# Altium schematic sheet JTAG.SchDoc: TAG Connector
size A4; DocumentNumber: MB1248; Revision: A.1; SheetNumber: 12; SheetTotal: 14; Project: STM32H7-DK
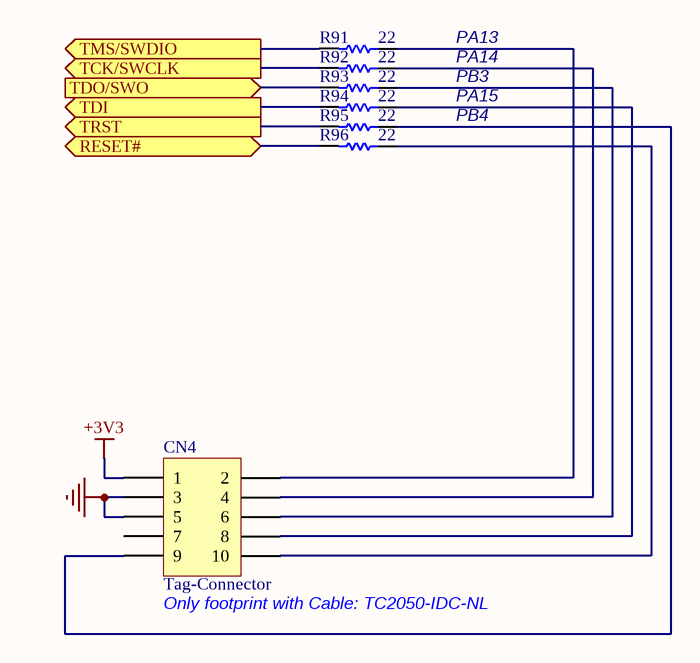
[diagram p0: JTAG.SchDoc]

## Parts
CN4  Tag-Connector  [TC2050-IDC-FP]
R91  22  [0603R]
R92  22  [0603R]
R93  22  [0603R]
R94  22  [0603R]
R95  22  [0603R]
R96  22  [0603R]

## Ports
RESET# (bidir), TCK/SWCLK (out), TDI (out), TDO/SWO (in), TMS/SWDIO (out), TRST (out)

## Nets
+3V3: CN4.1
GND: CN4.3 CN4.5
RESET#: R96.2 ; port RESET#
TCK/SWCLK: R92.2 ; port TCK/SWCLK
TDI: R94.2 ; port TDI
TDO/SWO: R93.2 ; port TDO/SWO
TMS/SWDIO: R91.2 ; port TMS/SWDIO
TRST: R95.2 ; port TRST
NetCN4_2: CN4.2 R91.1
NetCN4_4: CN4.4 R92.1
NetCN4_6: CN4.6 R93.1
NetCN4_8: CN4.8 R94.1
NetCN4_9: CN4.9 R95.1
NetCN4_10: CN4.10 R96.1

Not connected (* = marked no-connect by the designer): CN4 7

## Notes on the sheet
- PA13
- PA14
- PB3
- PA15
- PB4
- (near CN4) Only footprint with Cable: TC2050-IDC-NL
- Title:
- Project:
- Size:
- Date:
- A4
- Reference:
- Sheet:
- Revision:
- of

## Library data of the parts
CN4 = Tag-Connector: Header, 6-Pin, Dual row; Revision: 17-Jul-2002: Re-released for DXP Platform.; Publisher: Altium Limited
R91-R96 = Res1: Resistor; Value: 1K; Published: 8-Jun-2000; Revision: July-2002: Re-released for DXP Platform.; Publisher: Altium Limited